# Altium schematic sheet Sensor_node.SchDoc
size A4; SheetNumber: 2; SheetTotal: 2
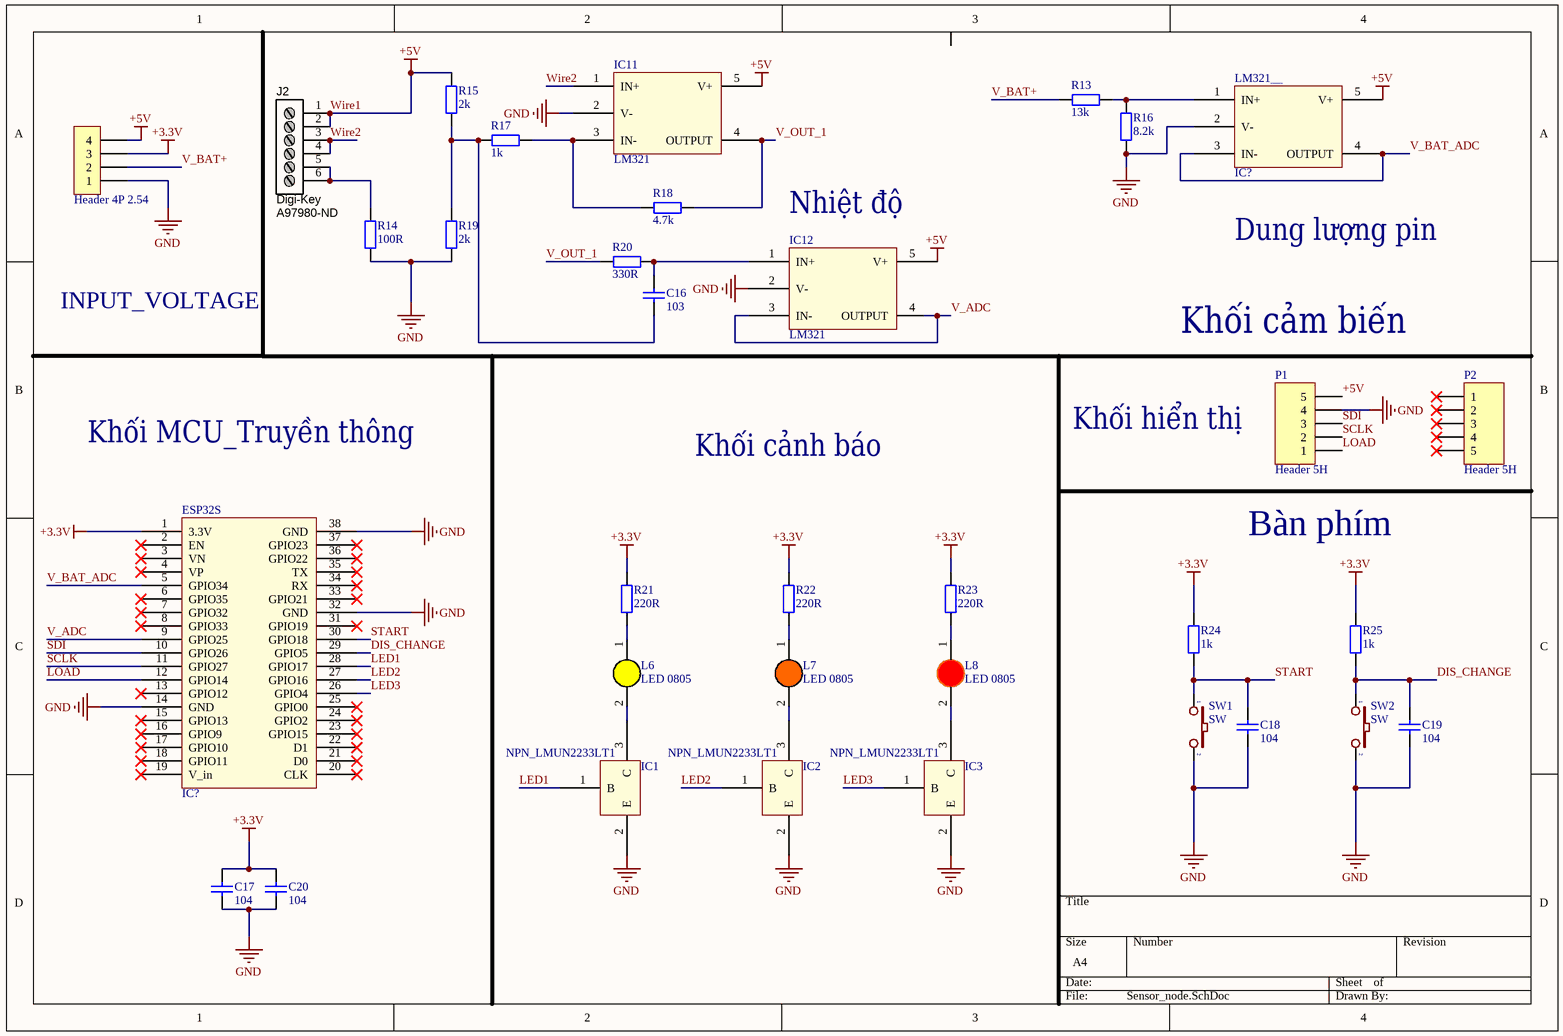
[diagram p0: Sensor_node.SchDoc]

## Parts
C16  103  [tu gom]
C17  104  [tu 1206]
C18  104  [tu gom]
C19  104  [tu gom]
C20  104  [tu 1206]
ESP32S  IC?  [ESP32 DEVKIT]
H2  Header 4P 2.54  [XH2.54M-4]
IC1  NPN_LMUN2233LT1  [SOT23_LMUN2233_trans]
IC2  NPN_LMUN2233LT1  [SOT23_LMUN2233_trans]
IC3  NPN_LMUN2233LT1  [SOT23_LMUN2233_trans]
IC11  LM321  [SOT23_LM321]
IC12  LM321  [SOT23_LM321]
J2  Supplier 1: Digi-Key  Supplier Part Number 1: A97980-ND  [6P_PCB_ScrewTerm_90S_3.81MM]  (hidden comment: Stackable ScrewTerm)
L6  LED 0805  [LED-0805-Yellow]
L7  LED 0805  [LED-0805-Orange]
L8  LED 0805  [LED-0805-Red]
LM321__  IC?  [SOT23_LM321]
P1  Header 5H  [HDR1X5H]
P2  Header 5H  [HDR1X5H]
R13  13k  [tro smd 0805]
R14  100R  [tro smd 1206]
R15  2k  [tro smd 1206]
R16  8.2k  [tro smd 0805]
R17  1k  [tro smd 0805]
R18  4.7k  [tro smd 0805]
R19  2k  [tro smd 1206]
R20  330R  [Tro SMD 0805]
R21  220R  [tro smd 0805]
R22  220R  [tro smd 0805]
R23  220R  [tro smd 0805]
R24  1k  [tro smd 0805]
R25  1k  [tro smd 0805]
SW1  SW  [SW2]
SW2  SW  [SW2]

## Nets
+3.3V: C17.1 C20.1 ESP32S.1(3.3V) H2.3 R21.2 R22.2 R23.2 R24.2 R25.2
+5V: H2.4 IC11.5(V+) IC12.5(V+) J2.1 J2.2 LM321__.5(V+) P1.5 R15.2  [also labelled Wire1]
GND: C17.2 C18.2 C19.2 C20.2 ESP32S.14(GND) ESP32S.32(GND) ESP32S.38(GND) H2.1 IC1.2(E) IC2.2(E) IC3.2(E) IC11.2(V-) IC12.2(V-) LM321__.2(V-) P1.4 R14.1 R16.1 R19.1 SW1.2 SW2.2
DIS_CHANGE: C19.1 ESP32S.29(GPIO5) R25.1 SW2.1
LED1: ESP32S.28(GPIO17) IC1.1(B)
LED2: ESP32S.27(GPIO16) IC2.1(B)
LED3: ESP32S.26(GPIO4) IC3.1(B)
LOAD: ESP32S.12(GPIO14) P1.1
SCLK: ESP32S.11(GPIO27) P1.2
SDI: ESP32S.10(GPIO26) P1.3
START: C18.1 ESP32S.30(GPIO18) R24.1 SW1.1
V_ADC: ESP32S.9(GPIO25) IC12.3(IN-) IC12.4(OUTPUT)
V_BAT+: H2.2 R13.1
V_BAT_ADC: ESP32S.5(GPIO34) LM321__.3(IN-) LM321__.4(OUTPUT)
V_OUT_1: IC11.4(OUTPUT) R18.2 R20.1
Wire2: IC11.1(IN+) J2.3 J2.4
NetC16_1: C16.1 IC12.1(IN+) R20.2
NetC16_2: C16.2 R15.1 R17.1 R19.2
NetIC1_3: IC1.3(C) L6.2(K)
NetIC2_3: IC2.3(C) L7.2(K)
NetIC3_3: IC3.3(C) L8.2(K)
NetIC11_3: IC11.3(IN-) R17.2 R18.1
NetJ2_5: J2.5 J2.6 R14.2
NetL6_1: L6.1(A) R21.1
NetL7_1: L7.1(A) R22.1
NetL8_1: L8.1(A) R23.1
NetLM321___1: LM321__.1(IN+) R13.2 R16.2

Not connected (* = marked no-connect by the designer): ESP32S 2(EN)* 3(VN)* 4(VP)* 6(GPIO35)* 7(GPIO32)* 8(GPIO33)* 13(GPIO12)* 15(GPIO13)* 16(GPIO9)* 17(GPIO10)* 18(GPIO11)* 19(V_in)* 20(CLK)* 21(D0)* 22(D1)* 23(GPIO15)* 24(GPIO2)* 25(GPIO0)* 31(GPIO19)* 33(GPIO21)* 34(RX)* 35(TX)* 36(GPIO22)* 37(GPIO23)*; P2 1* 2* 3* 4* 5*

## Notes on the sheet
- (near IC12) Nhiệt độ
- Dung lượng pin
- INPUT_VOLTAGE
- Khối cảm biến
- Khối MCU_Truyền thông
- (near P1) Khối hiển thị
- Khối cảnh báo
- Bàn phím

## Library data of the parts
C16 = Tu gom 103 50V: Cắm; So_Chan: 2; Ten_Linh_Kien: Tụ gốm 103 10nF 50V; Don_Vi: Con; Ma_Hang: MH000936; Chung_Loai: Cắm; Kieu_Chan: *
C17 C20 = Tu 1206 104 50V 20%: Dán; Don_Vi: Con; So_Chan: 2; Ten_Linh_Kien: Tụ 1206 104-0.1uF 20% 50V; Ma_Hang: MH004544; Chung_Loai: Dán; Kieu_Chan: *
C18 C19 = Tu gom 104 50V: Cắm; So_Chan: 2; Ten_Linh_Kien: Tụ gốm 104 100nF 50V; Don_Vi: Con; Ma_Hang: MH004761; Chung_Loai: Cắm; Kieu_Chan: *
H2 = Header 4P 2.54 Duc Thang: Cắm; Ten_Linh_Kien: Header 4P XH2.54-4P Đực Thẳng; Don_Vi: Con; Ma_Hang: MH001285; Chung_Loai: Cắm
J2 = 6P_ScrewTerm_90S_3.81MM: Terminal Block, THT, 6-Position screwterm, 3.81mm pitch; Manufacturer 1: Tyco Electronics; Manufacturer Part Number 1: 1776113-6; Value: 6 position; Pitch: 0.150" (3.81mm); Positions Per Level: 6; SCDType: undef; Package / Case: Side Entry; 3.81mm pitch; Category: Connectors Interconnects; Color: Black
L6 = LED 0805 Vang: Dán; Don_Vi: Con; Ma_Hang: MH002329; Ten_Linh_Kien: LED 0805 Màu Vàng ( Yellow); Ghi_Chu: *; Kieu_Chan: *; Chung_Loai: Dán
L7 = LED 0805 Cam: Dán; Don_Vi: Con; Ma_Hang: MH002328; Ten_Linh_Kien: LED 0805 Màu Cam ( Orange); Ghi_Chu: *; Kieu_Chan: *; Chung_Loai: Dán
L8 = LED 0805 Do: Dán; Don_Vi: Con; Ma_Hang: MH000897; Ten_Linh_Kien: LED 0805 Màu Đỏ (Red); Ghi_Chu: *; Kieu_Chan: *; Chung_Loai: Dán
P1 P2 = Header 5H: Header, 5-Pin, Right Angle; LatestRevisionDate: 17-Jul-2002; LatestRevisionNote: Re-released for DXP Platform.; Publisher: Altium Limited
R13 = Tro 0805 5% 12k: Dán; Don_Vi: Con; So_Chan: 2; Ten_Linh_Kien: Trở 0805 5% 12k; Ma_Hang: MH005241; Chung_Loai: Dán; Kieu_Chan: *
R14 = Tro 1206 5% 100R: Dán; Don_Vi: Con; So_Chan: 2; Ten_Linh_Kien: Trở 1206 5% 100R; Ma_Hang: MH005922; Chung_Loai: Dán; Kieu_Chan: *
R15 R19 = Tro 1206 5% 2k: Dán; Don_Vi: Con; So_Chan: 2; Ten_Linh_Kien: Trở 1206 5% 2k; Ma_Hang: MH005907; Chung_Loai: Dán; Kieu_Chan: *
R16 = Tro 0805 5% 8.2k: Dán; Don_Vi: Con; So_Chan: 2; Ten_Linh_Kien: Trở 0805 5% 8.2k; Ma_Hang: MH005312; Chung_Loai: Dán; Kieu_Chan: *
R17 R24 R25 = Tro 0805 5% 1k: Dán; Don_Vi: Con; So_Chan: 2; Ten_Linh_Kien: Trở 0805 5% 1k; Ma_Hang: MH005234; Chung_Loai: Dán; Kieu_Chan: *
R18 = Tro 0805 5% 4.7k: Dán; Don_Vi: Con; So_Chan: 2; Ten_Linh_Kien: Trở 0805 5% 4.7k; Ma_Hang: MH005307; Chung_Loai: Dán; Kieu_Chan: *
R20 = Tro 0805 5% 330R: Dán; Don_Vi: Con; So_Chan: 2; Ten_Linh_Kien: Trở 0805 5% 330R; Ma_Hang: MH005337; Chung_Loai: Dán; Kieu_Chan: *
R21-R23 = Tro 0805 5% 220R: Dán; Don_Vi: Con; So_Chan: 2; Ten_Linh_Kien: Trở 0805 5% 220R; Ma_Hang: MH005259; Chung_Loai: Dán; Kieu_Chan: *
SW1 SW2 = SW2: Switch button 2 pin; Value: SW chip 2 pin